# Altium schematic sheet SSL-2020-PowerBoard1.SchDoc
size A4
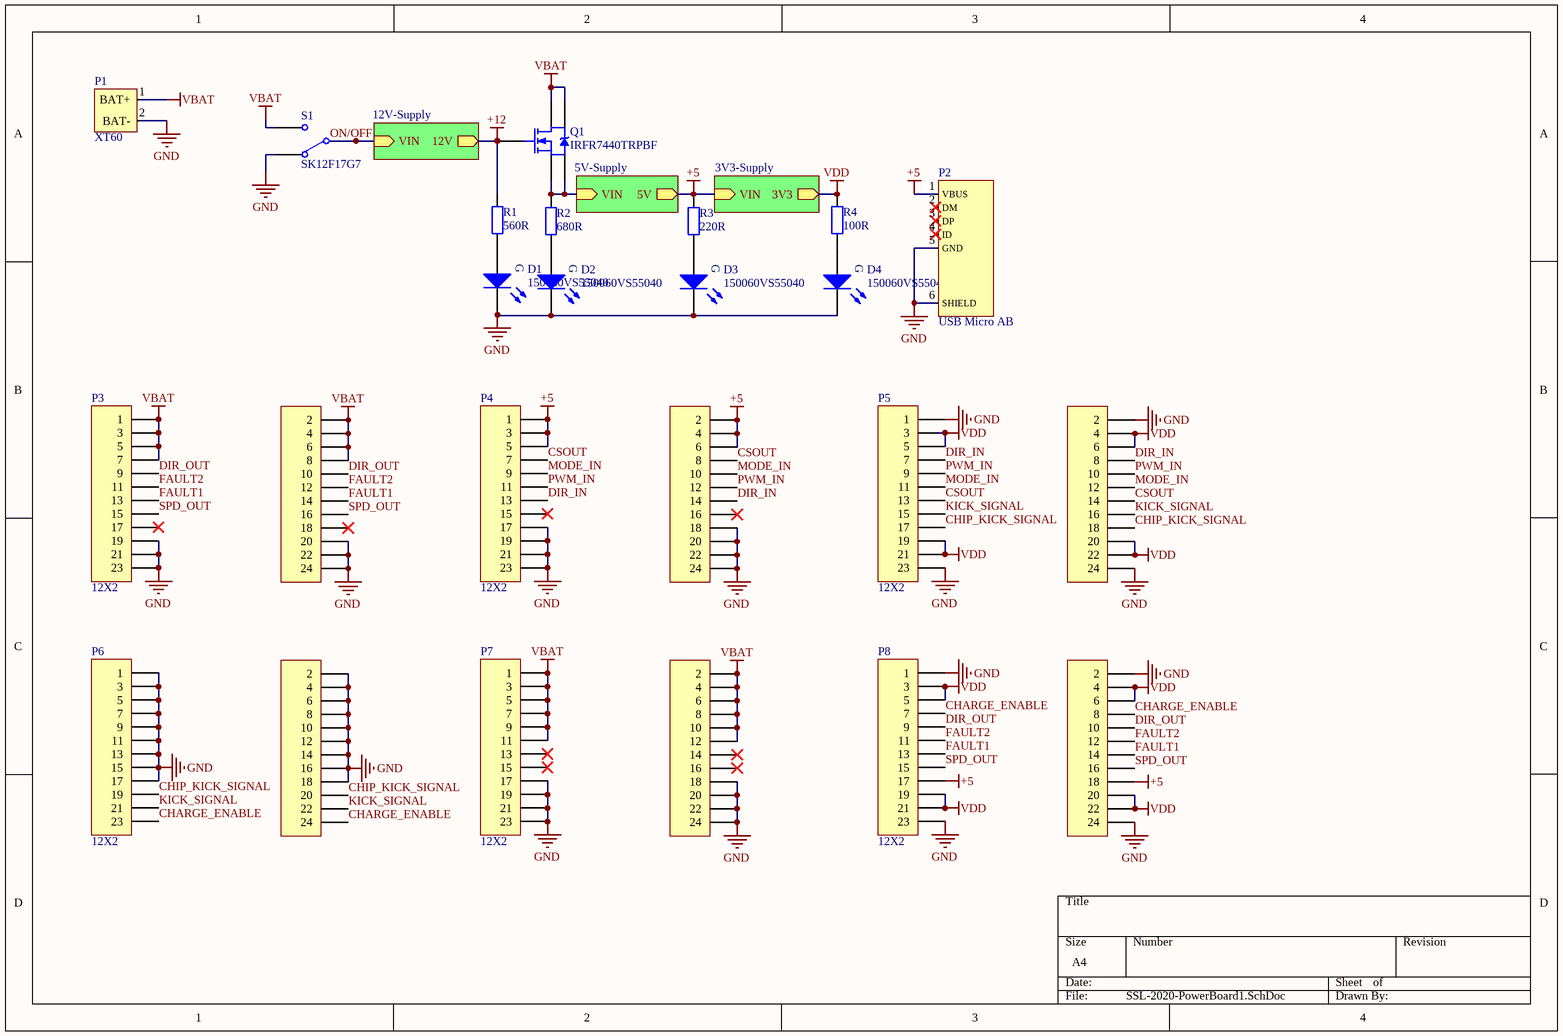
[diagram p0: SSL-2020-PowerBoard1.SchDoc]

## Parts
D1  150060VS55040  [LED 0603 GREEN]
D2  150060VS55040  [LED 0603 GREEN]
D3  150060VS55040  [LED 0603 GREEN]
D4  150060VS55040  [LED 0603 GREEN]
P1  XT60  [XT60-Male]
P2  USB Micro AB  [USB-MICRO-AB]
P3  12X2  [HEADER 12X2 FEM]
P4  12X2  [HEADER 12X2 FEM]
P5  12X2  [HEADER 12X2 FEM]
P6  12X2  [HEADER 12X2 FEM]
P7  12X2  [HEADER 12X2 FEM]
P8  12X2  [HEADER 12X2 FEM]
Q1  IRFR7440TRPBF  [DPAK/TO-252-3]
R1  560R  [RES SMD 0603]
R2  680R  [RES SMD 0603]
R3  220R  [RES SMD 0603]
R4  100R  [RES SMD 0603]
S1  SK12F17G7  [SPDT-SWITCH]

## Sub-sheets
3V3-Supply = VREG_3V3.SchDoc: VIN (in), 3V3 (out)
5V-Supply = VREG_5V.SchDoc: VIN (in), 5V (out)
12V-Supply = VREG_12V.SchDoc: VIN (in), 12V (out)

## Nets
+5: P2.1(VBUS) P4.1 P4.2 P4.3 P4.4 P4.5 P4.6 P8.17 P8.18 R3.2 ; sheet 5V-Supply/5V, sheet 3V3-Supply/VIN
+12: Q1.1(G) R1.2 ; sheet 12V-Supply/12V
GND: D1.2(N) D2.2(N) D3.2(N) D4.2(N) P1.2(BAT-) P2.5(GND) P2.6(SHIELD) P3.19 P3.20 P3.21 P3.22 P3.23 P3.24 P4.17 P4.18 P4.19 P4.20 P4.21 P4.22 P4.23 P4.24 P5.1 P5.2 P5.23 P5.24 P6.1 P6.2 P6.3 P6.4 P6.5 P6.6 P6.7 P6.8 P6.9 P6.10 P6.11 P6.12 P6.13 P6.14 P6.15 P6.16 P6.17 P6.18 P7.17 P7.18 P7.19 P7.20 P7.21 P7.22 P7.23 P7.24 P8.1 P8.2 P8.23 P8.24 S1.1(NC1)
VBAT: P1.1(BAT+) P3.1 P3.2 P3.3 P3.4 P3.5 P3.6 P3.7 P3.8 P7.1 P7.2 P7.3 P7.4 P7.5 P7.6 P7.7 P7.8 P7.9 P7.10 P7.11 P7.12 Q1.2(D) S1.3(NO1)
VDD: P5.3 P5.4 P5.5 P5.6 P5.19 P5.20 P5.21 P5.22 P8.3 P8.4 P8.5 P8.6 P8.19 P8.20 P8.21 P8.22 R4.2 ; sheet 3V3-Supply/3V3
CHARGE_ENABLE: P6.23 P6.24 P8.7 P8.8
CHIP_KICK_SIGNAL: P5.17 P5.18 P6.19 P6.20
CSOUT: P4.7 P4.8 P5.13 P5.14
DIR_IN: P4.13 P4.14 P5.7 P5.8
DIR_OUT: P3.9 P3.10 P8.9 P8.10
FAULT1: P3.13 P3.14 P8.13 P8.14
FAULT2: P3.11 P3.12 P8.11 P8.12
KICK_SIGNAL: P5.15 P5.16 P6.21 P6.22
MODE_IN: P4.9 P4.10 P5.11 P5.12
ON/OFF: S1.2(COMMON1) ; sheet 12V-Supply/VIN
PWM_IN: P4.11 P4.12 P5.9 P5.10
SPD_OUT: P3.15 P3.16 P8.15 P8.16
NetD1_1: D1.1(P) R1.1
NetD2_1: D2.1(P) R2.1
NetD3_1: D3.1(P) R3.1
NetD4_1: D4.1(P) R4.1
NetQ1_3: Q1.3(S) R2.2 ; sheet 5V-Supply/VIN

Not connected (* = marked no-connect by the designer): P2 2(DM)* 3(DP)* 4(ID)*; P3 17* 18*; P4 15* 16*; P7 13* 14* 15* 16*

## Notes on the sheet
- (in symbol 150060VS55040) G

## Library data of the parts
D1-D4 = 150060VS55040: Standard LEDs - SMD WL-SMCD SMD MonoChip 0603 BrtGrn 575nm; Mfr: Wurth Elektronik; Forward Current: 20mA; Forward Voltage: 2V; Color: Green; Package: 0603 (1608 metric); Series: WL-SMCD
P1 = XT60: DFRobot Accessories High Quality Gold Plated XT60 Male &amp; Female Bullet Connector; Mfr Nr: FIT0587; Mfr: DFRobot; Type: XT60 Male Connector
P2 = USB Micro AB: USB Connectors WR-COM USB Micro SMT Type AB Horiztl; Mfr: Wurth Elektronik; Mfr Nr: 629105150921; Current Rating: 1.8 A; Gender: Jack (Female); Type: Micro USB AB; Series: WR-COM
P3-P8 = HEADER 12P FEM: Headers & Wire Housings 12+12 DIL VERTICAL SOCKET GOLD+TIN; Mfr: Harwin; Mfr Nr: M20-7831242; Pitch: 2.54mm; Series: M20; Type: Socket Assembly
Q1 = IRFR7440TRPBF: MOSFET 40V 90A 2.5mOhm 89nC StrongIRFET; Mfr: Infineon / IR; Type: N-Channel MOSFET; Package: TO-252-3
R1 = RES SMD 0603 560R: Thick Film Resistors 1/10watt 560ohms 5%; Mfr: Vishay / Dale; Mfr Nr: CRCW0603560RJNEA; Power Rating: 1/10 W; Dimensions: 0603 (1608 metric); Value: 560R
R2 = RES SMD 0603 680R: Thick Film Resistors 1/10Watt 680ohms 5% Commercial Use; Mfr: Vishay / Dale; Mfr Nr: CRCW0603680RJNEAC; Power Rating: 1/10 W; Dimensions: 0603 (1608 metric); Value: 680R
R3 = RES SMD 0603 220R: Thick Film Resistors 1/10Watt 220ohms 5% Commercial Use; Mfr: Vishay / Dale; Mfr Nr: CRCW0603220RJNEAC; Power Rating: 1/10 W; Dimensions: 0603 (1608 metric); Value: 220R
R4 = RES SMD 0603 100R: Thick Film Resistors 1/10Watt 100ohms 1% Commercial Use; Mfr: Vishay / Dale; Mfr Nr: CRCW0603100RFKEAC; Power Rating: 1/10 W; Dimensions: 0603 (1608 metric); Value: 100R
S1 = SK12F17G7: Slide Switches SPDT 0.3 Amp at 30 V; Mfr: C&K; Current Rating: 300 mA; Voltage Rating: 30 VDC; Contact Form: SPDT; Type: Slide Switch; Series: SK